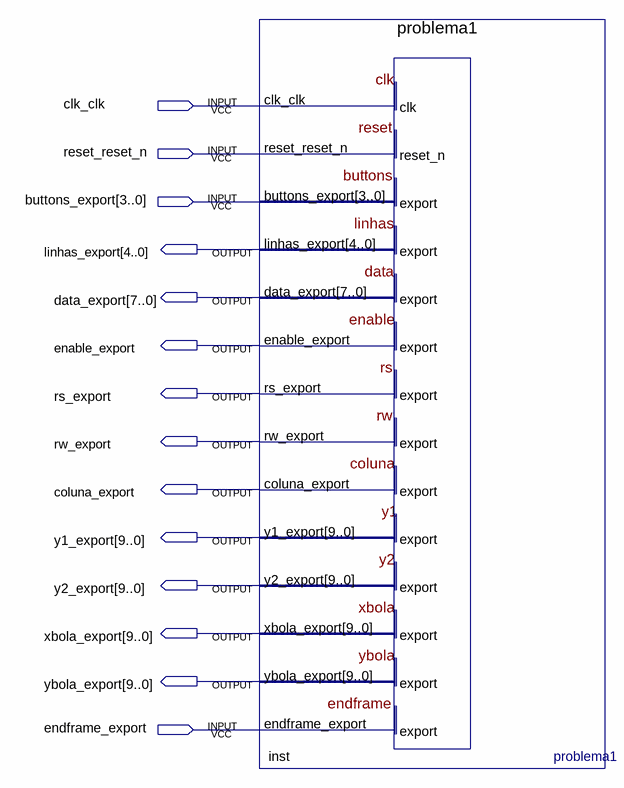
[diagram p0: schematic sheet]
// Quartus schematic problema1.bdf as structural Verilog: 1 symbols, 14 pins
module problema1 (
  input  clk_clk,
  input  reset_reset_n,
  input  [3:0] buttons_export,
  input  endframe_export,
  output [4:0] linhas_export,
  output [7:0] data_export,
  output enable_export,
  output rs_export,
  output rw_export,
  output coluna_export,
  output [9:0] y1_export,
  output [9:0] y2_export,
  output [9:0] xbola_export,
  output [9:0] ybola_export
);

  problema1 inst (
    .clk_clk(clk_clk), .reset_reset_n(reset_reset_n), .buttons_export(buttons_export),
    .endframe_export(endframe_export), .linhas_export(linhas_export), .data_export(data_export),
    .enable_export(enable_export), .rs_export(rs_export), .rw_export(rw_export),
    .coluna_export(coluna_export), .y1_export(y1_export), .y2_export(y2_export), .xbola_export(xbola_export),
    .ybola_export(ybola_export));
endmodule
